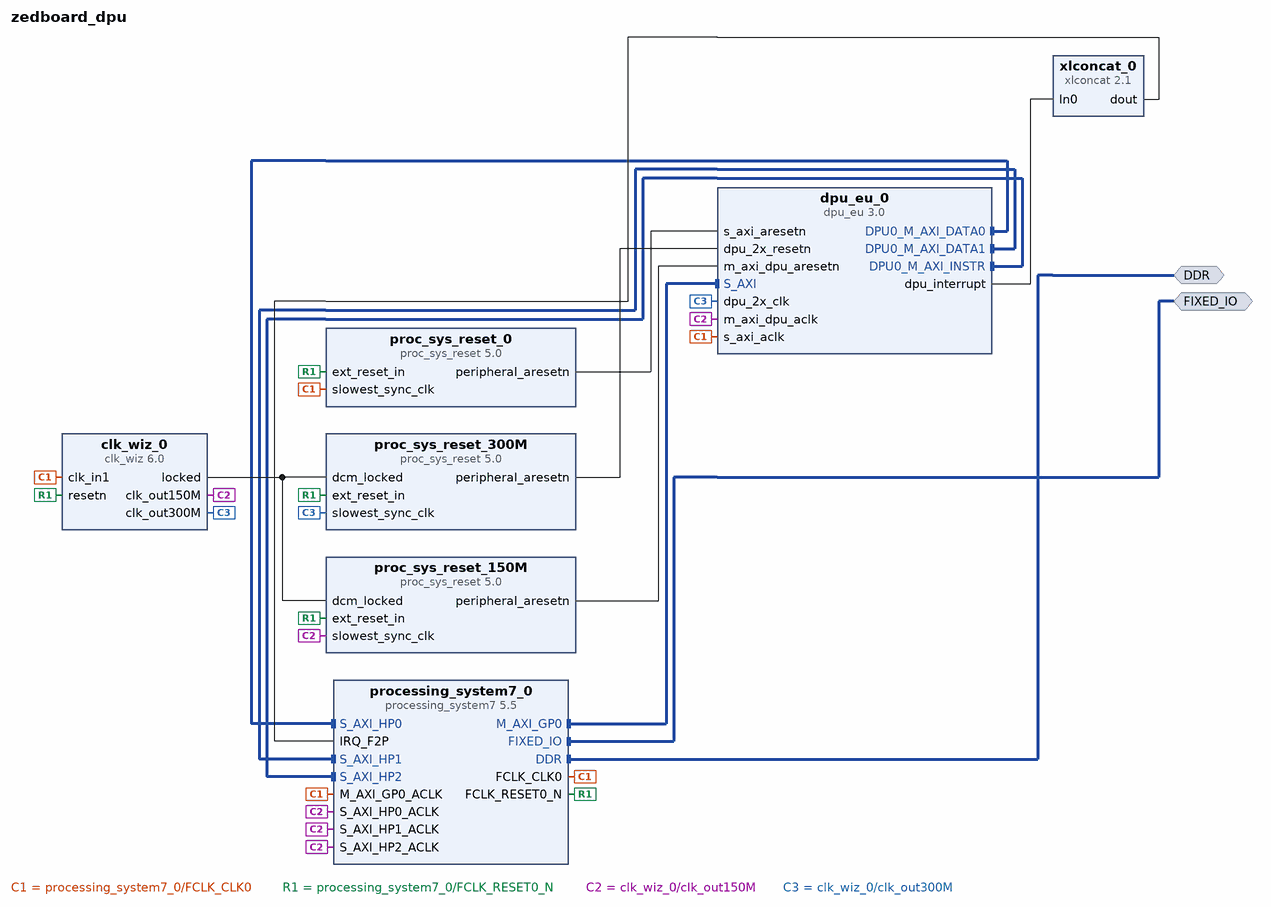
[diagram p0: block diagram of the top level]
# Vivado block design zedboard_dpu, xc7z020clg484-1, Vivado 2020.1
create_bd_design zedboard_dpu

create_bd_intf_port -mode Master -vlnv xilinx.com:interface:ddrx_rtl:1.0 DDR
create_bd_intf_port -mode Master -vlnv xilinx.com:display_processing_system7:fixedio_rtl:1.0 FIXED_IO

create_bd_cell -type ip -vlnv xilinx.com:ip:processing_system7:5.5 processing_system7_0
set_property -dict [list \
  CONFIG.PCW_APU_PERIPHERAL_FREQMHZ 666.666667 \
  CONFIG.PCW_ENET0_ENET0_IO {MIO 16 .. 27} \
  CONFIG.PCW_ENET0_GRP_MDIO_ENABLE 1 \
  CONFIG.PCW_ENET0_GRP_MDIO_IO {MIO 52 .. 53} \
  CONFIG.PCW_ENET0_PERIPHERAL_ENABLE 1 \
  CONFIG.PCW_ENET0_RESET_ENABLE 0 \
  CONFIG.PCW_ENET_RESET_ENABLE 1 \
  CONFIG.PCW_ENET_RESET_SELECT {Share reset pin} \
  CONFIG.PCW_FPGA0_PERIPHERAL_FREQMHZ 100.000000 \
  CONFIG.PCW_FPGA1_PERIPHERAL_FREQMHZ 150.000000 \
  CONFIG.PCW_FPGA2_PERIPHERAL_FREQMHZ 50.000000 \
  CONFIG.PCW_GPIO_MIO_GPIO_ENABLE 1 \
  CONFIG.PCW_GPIO_MIO_GPIO_IO MIO \
  CONFIG.PCW_I2C_RESET_ENABLE 1 \
  CONFIG.PCW_IRQ_F2P_INTR 1 \
  CONFIG.PCW_PRESET_BANK1_VOLTAGE {LVCMOS 1.8V} \
  CONFIG.PCW_QSPI_GRP_SINGLE_SS_ENABLE 1 \
  CONFIG.PCW_QSPI_GRP_SINGLE_SS_IO {MIO 1 .. 6} \
  CONFIG.PCW_QSPI_PERIPHERAL_ENABLE 1 \
  CONFIG.PCW_QSPI_PERIPHERAL_FREQMHZ 200.000000 \
  CONFIG.PCW_QSPI_QSPI_IO {MIO 1 .. 6} \
  CONFIG.PCW_SD0_GRP_CD_ENABLE 1 \
  CONFIG.PCW_SD0_GRP_CD_IO {MIO 47} \
  CONFIG.PCW_SD0_GRP_WP_ENABLE 1 \
  CONFIG.PCW_SD0_GRP_WP_IO {MIO 46} \
  CONFIG.PCW_SD0_PERIPHERAL_ENABLE 1 \
  CONFIG.PCW_SD0_SD0_IO {MIO 40 .. 45} \
  CONFIG.PCW_SDIO_PERIPHERAL_FREQMHZ 50 \
  CONFIG.PCW_SINGLE_QSPI_DATA_MODE x4 \
  CONFIG.PCW_S_AXI_HP2_DATA_WIDTH 32 \
  CONFIG.PCW_TTC0_PERIPHERAL_ENABLE 1 \
  CONFIG.PCW_TTC0_TTC0_IO EMIO \
  CONFIG.PCW_UART1_PERIPHERAL_ENABLE 1 \
  CONFIG.PCW_UART1_UART1_IO {MIO 48 .. 49} \
  CONFIG.PCW_UART_PERIPHERAL_FREQMHZ 50 \
  CONFIG.PCW_UIPARAM_DDR_FREQ_MHZ 533.333313 \
  CONFIG.PCW_UIPARAM_DDR_PARTNO {MT41J128M16 HA-15E} \
  CONFIG.PCW_USB0_PERIPHERAL_ENABLE 1 \
  CONFIG.PCW_USB0_RESET_ENABLE 0 \
  CONFIG.PCW_USB0_USB0_IO {MIO 28 .. 39} \
  CONFIG.PCW_USB_RESET_ENABLE 1 \
  CONFIG.PCW_USB_RESET_SELECT {Share reset pin} \
  CONFIG.PCW_USE_FABRIC_INTERRUPT 1 \
  CONFIG.PCW_USE_S_AXI_HP0 1 \
  CONFIG.PCW_USE_S_AXI_HP1 1 \
  CONFIG.PCW_USE_S_AXI_HP2 1 \
  CONFIG.preset ZedBoard \
] [get_bd_cells processing_system7_0]
# 221 more settings of processing_system7_0 are not shown: defaults, MIO pin electricals, DDR timing, and values the tool derives
create_bd_cell -type ip -vlnv xilinx.com:ip:dpu_eu:3.0 dpu_eu_0
set_property -dict [list \
  CONFIG.ARCH 1152 \
  CONFIG.TIME_DAY 22 \
  CONFIG.TIME_HOUR 15 \
  CONFIG.TIME_MONTH 12 \
  CONFIG.TIME_QUARTER 0 \
  CONFIG.TIME_YEAR 24 \
] [get_bd_cells dpu_eu_0]
create_bd_cell -type ip -vlnv xilinx.com:ip:xlconcat:2.1 xlconcat_0
create_bd_cell -type ip -vlnv xilinx.com:ip:proc_sys_reset:5.0 proc_sys_reset_300M
create_bd_cell -type ip -vlnv xilinx.com:ip:proc_sys_reset:5.0 proc_sys_reset_150M
create_bd_cell -type ip -vlnv xilinx.com:ip:proc_sys_reset:5.0 proc_sys_reset_0
create_bd_cell -type ip -vlnv xilinx.com:ip:clk_wiz:6.0 clk_wiz_0
set_property -dict [list \
  CONFIG.CLKOUT1_JITTER 127.220 \
  CONFIG.CLKOUT1_PHASE_ERROR 105.461 \
  CONFIG.CLKOUT1_REQUESTED_OUT_FREQ 150.000 \
  CONFIG.CLKOUT2_JITTER 111.879 \
  CONFIG.CLKOUT2_PHASE_ERROR 105.461 \
  CONFIG.CLKOUT2_REQUESTED_OUT_FREQ 300.000 \
  CONFIG.CLKOUT2_USED true \
  CONFIG.CLK_OUT1_PORT clk_out150M \
  CONFIG.CLK_OUT2_PORT clk_out300M \
  CONFIG.MMCM_CLKFBOUT_MULT_F 9.000 \
  CONFIG.MMCM_CLKOUT0_DIVIDE_F 6.000 \
  CONFIG.MMCM_CLKOUT1_DIVIDE 3 \
  CONFIG.NUM_OUT_CLKS 2 \
  CONFIG.RESET_PORT resetn \
  CONFIG.RESET_TYPE ACTIVE_LOW \
] [get_bd_cells clk_wiz_0]

# ---- connections ----

connect_bd_intf_net [get_bd_intf_pins dpu_eu_0/DPU0_M_AXI_DATA0] [get_bd_intf_pins processing_system7_0/S_AXI_HP0]
connect_bd_intf_net [get_bd_intf_pins dpu_eu_0/S_AXI] [get_bd_intf_pins processing_system7_0/M_AXI_GP0]
connect_bd_intf_net [get_bd_intf_ports FIXED_IO] [get_bd_intf_pins processing_system7_0/FIXED_IO]
connect_bd_intf_net [get_bd_intf_ports DDR] [get_bd_intf_pins processing_system7_0/DDR]
connect_bd_intf_net [get_bd_intf_pins dpu_eu_0/DPU0_M_AXI_DATA1] [get_bd_intf_pins processing_system7_0/S_AXI_HP1]
connect_bd_intf_net [get_bd_intf_pins dpu_eu_0/DPU0_M_AXI_INSTR] [get_bd_intf_pins processing_system7_0/S_AXI_HP2]
connect_bd_net [get_bd_pins xlconcat_0/dout] [get_bd_pins processing_system7_0/IRQ_F2P]
connect_bd_net [get_bd_pins dpu_eu_0/dpu_interrupt] [get_bd_pins xlconcat_0/In0]
connect_bd_net [get_bd_pins processing_system7_0/FCLK_CLK0] \
  [get_bd_pins clk_wiz_0/clk_in1] [get_bd_pins proc_sys_reset_0/slowest_sync_clk] [get_bd_pins dpu_eu_0/s_axi_aclk] \
  [get_bd_pins processing_system7_0/M_AXI_GP0_ACLK]
connect_bd_net [get_bd_pins processing_system7_0/FCLK_RESET0_N] \
  [get_bd_pins clk_wiz_0/resetn] [get_bd_pins proc_sys_reset_300M/ext_reset_in] \
  [get_bd_pins proc_sys_reset_150M/ext_reset_in] [get_bd_pins proc_sys_reset_0/ext_reset_in]
connect_bd_net [get_bd_pins clk_wiz_0/locked] [get_bd_pins proc_sys_reset_300M/dcm_locked] [get_bd_pins proc_sys_reset_150M/dcm_locked]
connect_bd_net [get_bd_pins clk_wiz_0/clk_out150M] \
  [get_bd_pins proc_sys_reset_150M/slowest_sync_clk] [get_bd_pins dpu_eu_0/m_axi_dpu_aclk] \
  [get_bd_pins processing_system7_0/S_AXI_HP0_ACLK] [get_bd_pins processing_system7_0/S_AXI_HP1_ACLK] \
  [get_bd_pins processing_system7_0/S_AXI_HP2_ACLK]
connect_bd_net [get_bd_pins clk_wiz_0/clk_out300M] [get_bd_pins proc_sys_reset_300M/slowest_sync_clk] [get_bd_pins dpu_eu_0/dpu_2x_clk]
connect_bd_net [get_bd_pins proc_sys_reset_150M/peripheral_aresetn] [get_bd_pins dpu_eu_0/m_axi_dpu_aresetn]
connect_bd_net [get_bd_pins proc_sys_reset_300M/peripheral_aresetn] [get_bd_pins dpu_eu_0/dpu_2x_resetn]
connect_bd_net [get_bd_pins proc_sys_reset_0/peripheral_aresetn] [get_bd_pins dpu_eu_0/s_axi_aresetn]

# ---- address map ----
assign_bd_address -offset 0x0000000000 -range 512M -target_address_space [get_bd_addr_spaces dpu_eu_0/DPU0_M_AXI_DATA0] [get_bd_addr_segs processing_system7_0/S_AXI_HP0/HP0_DDR_LOWOCM]
assign_bd_address -offset 0x0000000000 -range 512M -target_address_space [get_bd_addr_spaces dpu_eu_0/DPU0_M_AXI_DATA1] [get_bd_addr_segs processing_system7_0/S_AXI_HP1/HP1_DDR_LOWOCM]
assign_bd_address -offset 0x0000000000 -range 512M -target_address_space [get_bd_addr_spaces dpu_eu_0/DPU0_M_AXI_INSTR] [get_bd_addr_segs processing_system7_0/S_AXI_HP2/HP2_DDR_LOWOCM]
assign_bd_address -offset 0x4F000000 -range 16M -target_address_space [get_bd_addr_spaces processing_system7_0/Data] [get_bd_addr_segs dpu_eu_0/S_AXI/reg0]

validate_bd_design
save_bd_design
